# Altium schematic sheet General_Design.SchDoc
size A4
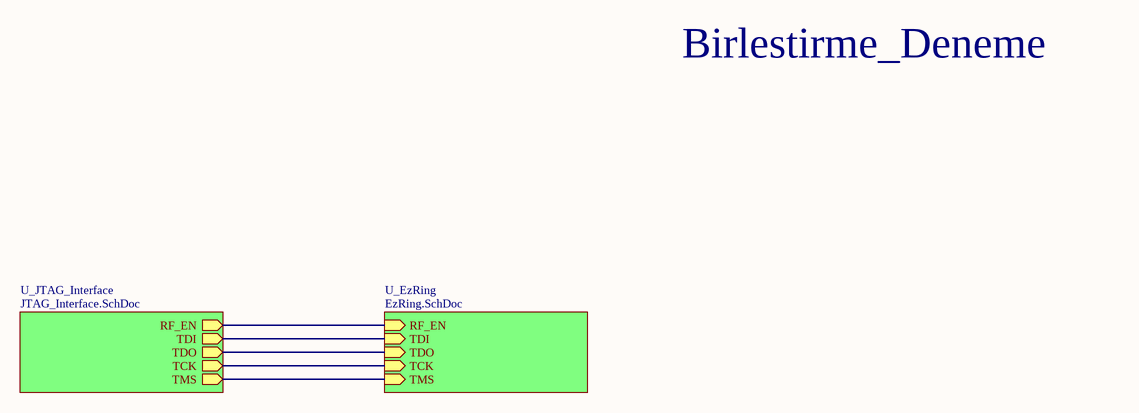
[diagram p0: General_Design.SchDoc]

## Sub-sheets
U_EzRing = EzRing.SchDoc: TDI (in), RF_EN (in), TCK (in), TDO (in), TMS (in)
U_JTAG_Interface = JTAG_Interface.SchDoc: TMS (out), TCK (out), TDO (out), TDI (out), RF_EN (out)

## Nets
(unnamed): sheet U_EzRing/TDI, sheet U_JTAG_Interface/TDI
(unnamed): sheet U_EzRing/RF_EN, sheet U_JTAG_Interface/RF_EN
(unnamed): sheet U_EzRing/TCK, sheet U_JTAG_Interface/TCK
(unnamed): sheet U_EzRing/TDO, sheet U_JTAG_Interface/TDO
(unnamed): sheet U_EzRing/TMS, sheet U_JTAG_Interface/TMS

## Notes on the sheet
- Birlestirme_Deneme